# Altium schematic sheet power1.SchDoc
size A4
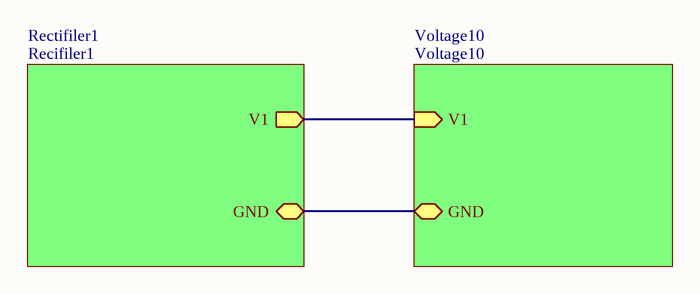
[diagram p0: power1.SchDoc]

## Sub-sheets
Rectifiler1 = Recifiler1: V1 (out), GND (bidir)
Voltage10 = Voltage10: V1 (in), GND (bidir)

## Nets
(unnamed): sheet Rectifiler1/V1, sheet Voltage10/V1
(unnamed): sheet Rectifiler1/GND, sheet Voltage10/GND